# EAGLE board AllInOne (EAGLE 6.2), part 1 of 2
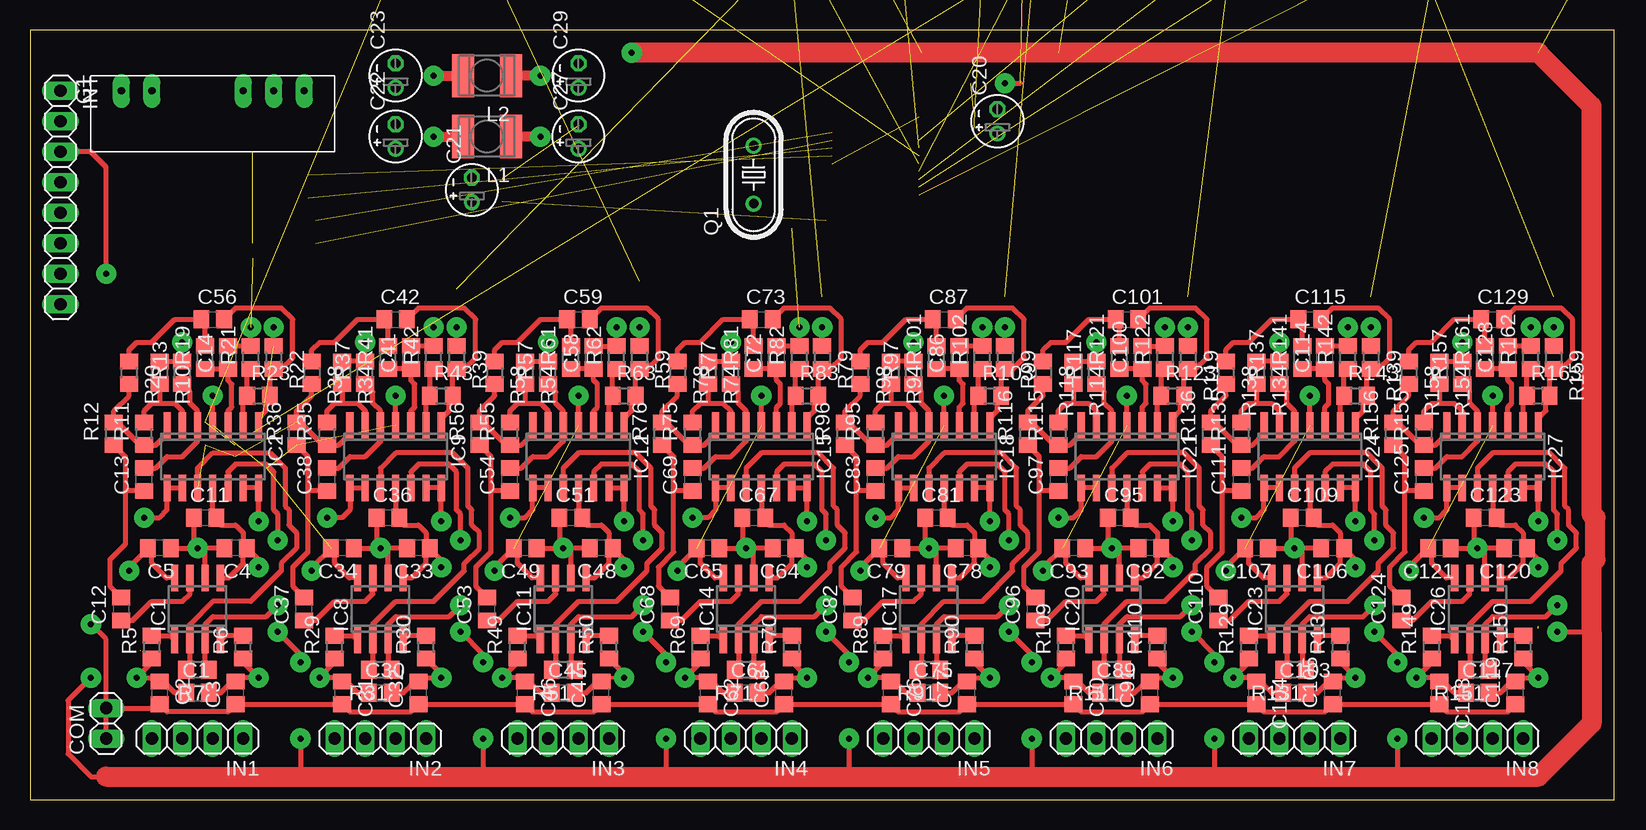
[diagram p6: board, top side]
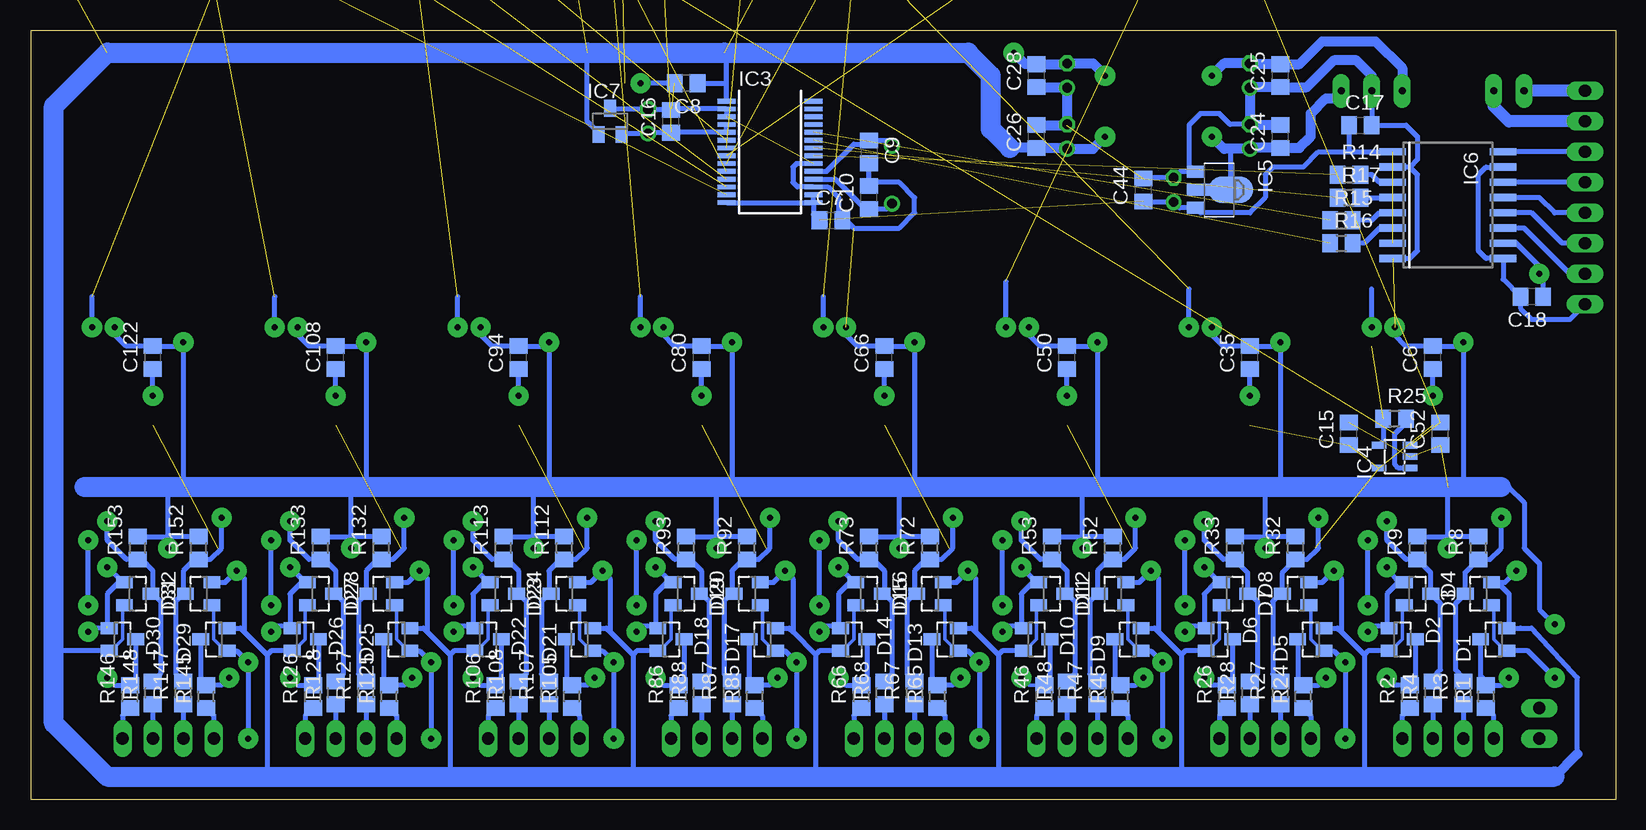
[diagram p7: board, bottom side, seen from below]

Size 132.07 x 64.12 mm. Coordinates in mm from the lower left corner, seen from the top.
Outline: 0,0 132.07,0 132.07,64.12 0,64.12 0,0
Copper layers (1*16): Top 0.035mm / dielectric 1.5mm / Bottom 0.035mm
Design rules: minimum track width 10mil, minimum drill 24mil, track to track 8mil, track to pad 8mil, pad to pad 8mil, via to via 8mil, smd to smd 8mil, copper to edge 40mil, drill to drill 8mil, minimum pad ring 10mil, minimum via ring 8mil, stop-mask expansion 4mil, vias tented up to drill 0mil, thermal gap 10mil

## Footprints (pad centres in the part's own frame; a part is rotated, then mirrored left to right if it is on the bottom)
C0805 = smd 1.3 x 1.5: 1 -0.95,0; 2 0.95,0
E2-4 = drill 0.813 pad 1.27: + -1.016,0 | drill 0.813 pad 1.27 octagon: - 1.016,0
1X02 = drill 1.016 long: 1 -1.27,0; 2 1.27,0
SOT23 = smd 1 x 1.4: 1 -0.95,-1.1; 2 0.95,-1.1; 3 0,1.1
TMV0505D = drill 0.6 pad 1.422 long: 1 0,7.62; 2 0,5.08; 5 0,-2.54; 6 0,-5.08; 7 0,-7.62
SO-08 = smd 0.6 x 2.2: 1 -1.905,-2.6; 2 -0.635,-2.6; 3 0.635,-2.6; 4 1.905,-2.6; 5 1.905,2.6; 6 0.635,2.6; 7 -0.635,2.6; 8 -1.905,2.6
TLC2254ID = smd 0.6 x 2.2: 1 -3.81,-2.6; 2 -2.54,-2.6; 3 -1.27,-2.6; 4 0,-2.6; 5 1.27,-2.6; 6 2.54,-2.6; 7 3.81,-2.6; 8 3.81,2.6; 9 2.54,2.6; 10 1.27,2.6; 11 0,2.6; 12 -1.27,2.6; 13 -2.54,2.6; 14 -3.81,2.6
ADS1256IDBT = smd 0.4 x 1.5: 1 -4.225,-3.625; 2 -3.575,-3.625; 3 -2.925,-3.625; 4 -2.275,-3.625; 5 -1.625,-3.625; 6 -0.975,-3.625; 7 -0.325,-3.625; 8 0.325,-3.625; 9 0.975,-3.625; 10 1.625,-3.625; 11 2.275,-3.625; 12 2.925,-3.625; 13 3.575,-3.625; 14 4.225,-3.625; 15 4.225,3.625; 16 3.575,3.625; 17 2.925,3.625; 18 2.275,3.625; 19 1.625,3.625; 20 0.975,3.625; 21 0.325,3.625; 22 -0.325,3.625; 23 -0.975,3.625; 24 -1.625,3.625; 25 -2.275,3.625; 26 -2.925,3.625; 27 -3.575,3.625; 28 -4.225,3.625
AD8605ARTZ = smd 0.55 x 1.2: 1 -0.95,-1.3; 2 0,-1.3; 3 0.95,-1.3; 4 0.95,1.3; 5 -0.95,1.3
SOT89 = smd 1 x 1.5: 1 -1.499,-1.981; 3 1.499,-1.981 | smd 1 x 2: 2 0,-1.727 | smd 2.2 x 3.7: 2@1 0,0.94
ADUM1402ARWZ = smd 0.6 x 2.2: 1 -4.445,-4.6; 2 -3.175,-4.6; 3 -1.905,-4.6; 4 -0.635,-4.6; 5 0.635,-4.6; 6 1.905,-4.6; 7 3.175,-4.6; 8 4.445,-4.6; 9 4.445,4.6; 10 3.175,4.6; 11 1.905,4.6; 12 0.635,4.6; 13 -0.635,4.6; 14 -1.905,4.6; 15 -3.175,4.6; 16 -4.445,4.6
REF3125AIDBZT = smd 1 x 1.4: 1 -0.95,-1.1; 2 0.95,-1.1; 3 0,1.1
1X04 = drill 1.016 long: 1 -3.81,0; 2 -1.27,0; 3 1.27,0; 4 3.81,0
1X08 = drill 1.016 long: 1 -8.89,0; 2 -6.35,0; 3 -3.81,0; 4 -1.27,0; 5 1.27,0; 6 3.81,0; 7 6.35,0; 8 8.89,0
L4532P = smd 1.8 x 3.6: 1 -2,0; 2 2,0
HC49U-V = drill 0.813: 1 -2.413,0; 2 2.413,0
R0805 = smd 1.3 x 1.5: 1 -0.95,0; 2 0.95,0

## Placement (x,y rotation side)
C1  10pF  [C0805]  13.97,8.89 0 top
C2  100pF  [C0805]  10.79,8.89 270 top
C3  100pF  [C0805]  17.14,8.89 90 top
C4  0.1  [C0805]  17.14,20.95 180 top
C5  0.1  [C0805]  10.79,20.95 180 top
C6  0.1  [C0805]  15.24,36.83 90 bottom
C7  0.1  [C0805]  65.41,48.26 0 bottom
C8  0.1  [C0805]  77.47,59.69 180 bottom
C9  18p  [C0805]  62.23,53.98 270 bottom
C10  18p  [C0805]  62.23,50.16 90 bottom
C11  0.1  [C0805]  14.61,23.5 0 top
C12  1u  [C0805]  7.62,15.88 90 top
C13  1u  [C0805]  9.53,26.67 90 top
C14  47n  [C0805]  16.51,36.83 90 top
C15  0.1  [C0805]  22.23,30.48 90 bottom
C16  0.1  [C0805]  78.74,56.52 90 bottom
C17  0.1  [C0805]  21.27,56.2 0 bottom
C18  0.1  [C0805]  6.99,41.91 180 bottom
C19  0.1  [C0805]  94.61,71.12 90 top  (outside the outline)
C20  47u  [E2-4]  80.64,56.52 90 top
C21  47u  [E2-4]  36.83,50.8 90 top
C22  47u  [E2-4]  30.48,55.24 90 top
C23  47u  [E2-4]  30.48,60.33 90 top
C24  0.1  [C0805]  27.94,55.24 90 bottom
C25  0.1  [C0805]  27.94,60.33 90 bottom
C26  0.1  [C0805]  48.26,55.24 90 bottom
C27  47u  [E2-4]  45.72,55.24 90 top
C28  0.1  [C0805]  48.26,60.33 90 bottom
C29  47u  [E2-4]  45.72,60.33 90 top
C30  10pF  [C0805]  29.21,8.89 0 top
C31  100pF  [C0805]  26.04,8.89 270 top
C32  100pF  [C0805]  32.38,8.89 90 top
C33  0.1  [C0805]  32.38,20.95 180 top
C34  0.1  [C0805]  26.04,20.95 180 top
C35  0.1  [C0805]  30.48,36.83 90 bottom
C36  0.1  [C0805]  29.84,23.5 0 top
C37  1u  [C0805]  22.86,15.88 90 top
C38  1u  [C0805]  24.77,26.67 90 top
C39  0.1  [C0805]  37.47,83.82 0 top  (outside the outline)
C40  0.1  [C0805]  96.52,85.72 270 top  (outside the outline)
C41  47n  [C0805]  31.75,36.83 90 top
C42  33n  [C0805]  30.48,40.01 0 top
C43  0.1  [C0805]  43.18,79.38 0 top  (outside the outline)
C44  0.1  [C0805]  39.37,50.8 90 bottom
C45  10pF  [C0805]  44.45,8.89 0 top
C46  100pF  [C0805]  41.27,8.89 270 top
C47  100pF  [C0805]  47.62,8.89 90 top
C48  0.1  [C0805]  47.62,20.95 180 top
C49  0.1  [C0805]  41.27,20.95 180 top
C50  0.1  [C0805]  45.72,36.83 90 bottom
C51  0.1  [C0805]  45.09,23.5 0 top
C52  0.1  [C0805]  14.61,30.48 90 bottom
C53  1u  [C0805]  38.1,15.88 90 top
C54  1u  [C0805]  40.01,26.67 90 top
C55  0.1  [C0805]  52.7,78.11 0 top  (outside the outline)
C56  33n  [C0805]  15.24,40.01 0 top
C57  0.1  [C0805]  31.75,74.93 0 top  (outside the outline)
C58  47n  [C0805]  46.99,36.83 90 top
C59  33n  [C0805]  45.72,40.01 0 top
C60  0.1  [C0805]  36.83,78.74 0 top  (outside the outline)
C61  10pF  [C0805]  59.69,8.89 0 top
C62  100pF  [C0805]  56.52,8.89 270 top
C63  100pF  [C0805]  62.87,8.89 90 top
C64  0.1  [C0805]  62.87,20.95 180 top
C65  0.1  [C0805]  56.52,20.95 180 top
C66  0.1  [C0805]  60.96,36.83 90 bottom
C67  0.1  [C0805]  60.33,23.5 0 top
C68  1u  [C0805]  53.34,15.88 90 top
C69  1u  [C0805]  55.24,26.67 90 top
C70  0.1  [C0805]  69.85,72.39 0 top  (outside the outline)
C71  0.1  [C0805]  55.24,73.66 0 top  (outside the outline)
C72  47n  [C0805]  62.23,36.83 90 top
C73  33n  [C0805]  60.96,40.01 0 top
C74  0.1  [C0805]  62.23,73.03 0 top  (outside the outline)
C75  10pF  [C0805]  74.93,8.89 0 top
C76  100pF  [C0805]  71.75,8.89 270 top
C77  100pF  [C0805]  78.11,8.89 90 top
C78  0.1  [C0805]  78.11,20.95 180 top
C79  0.1  [C0805]  71.75,20.95 180 top
C80  0.1  [C0805]  76.2,36.83 90 bottom
C81  0.1  [C0805]  75.56,23.5 0 top
C82  1u  [C0805]  68.58,15.88 90 top
C83  1u  [C0805]  70.48,26.67 90 top
C84  0.1  [C0805]  88.27,71.75 0 top  (outside the outline)
C85  0.1  [C0805]  78.74,75.56 0 top  (outside the outline)
C86  47n  [C0805]  77.47,36.83 90 top
C87  33n  [C0805]  76.2,40.01 0 top
C88  0.1  [C0805]  83.82,73.03 0 top  (outside the outline)
C89  10pF  [C0805]  90.17,8.89 0 top
C90  100pF  [C0805]  87,8.89 270 top
C91  100pF  [C0805]  93.34,8.89 90 top
C92  0.1  [C0805]  93.34,20.95 180 top
C93  0.1  [C0805]  87,20.95 180 top
C94  0.1  [C0805]  91.44,36.83 90 bottom
C95  0.1  [C0805]  90.81,23.5 0 top
C96  1u  [C0805]  83.82,15.88 90 top
C97  1u  [C0805]  85.72,26.67 90 top
C98  0.1  [C0805]  106.68,71.75 0 top  (outside the outline)
C99  0.1  [C0805]  111.76,71.75 0 top  (outside the outline)
C100  47n  [C0805]  92.71,36.83 90 top
C101  33n  [C0805]  91.44,40.01 0 top
C102  0.1  [C0805]  105.41,76.2 0 top  (outside the outline)
C103  10pF  [C0805]  105.41,8.89 0 top
C104  100pF  [C0805]  102.23,8.89 270 top
C105  100pF  [C0805]  108.58,8.89 90 top
C106  0.1  [C0805]  108.58,20.95 180 top
C107  0.1  [C0805]  102.23,20.95 180 top
C108  0.1  [C0805]  106.68,36.83 90 bottom
C109  0.1  [C0805]  106.05,23.5 0 top
C110  1u  [C0805]  99.06,15.88 90 top
C111  1u  [C0805]  100.97,26.67 90 top
C112  0.1  [C0805]  99.06,81.28 0 top  (outside the outline)
C113  0.1  [C0805]  111.12,81.92 0 top  (outside the outline)
C114  47n  [C0805]  107.95,36.83 90 top
C115  33n  [C0805]  106.68,40.01 0 top
C116  0.1  [C0805]  116.2,87 0 top  (outside the outline)
C117  10pF  [C0805]  120.65,8.89 0 top
C118  100pF  [C0805]  117.47,8.89 270 top
C119  100pF  [C0805]  123.83,8.89 90 top
C120  0.1  [C0805]  123.83,20.95 180 top
C121  0.1  [C0805]  117.47,20.95 180 top
C122  0.1  [C0805]  121.92,36.83 90 bottom
C123  0.1  [C0805]  121.28,23.5 0 top
C124  1u  [C0805]  114.3,15.88 90 top
C125  1u  [C0805]  116.2,26.67 90 top
C126  0.1  [C0805]  133.35,74.3 0 top  (outside the outline)
C127  0.1  [C0805]  142.24,65.41 0 top  (outside the outline)
C128  47n  [C0805]  123.19,36.83 90 top
C129  33n  [C0805]  121.92,40.01 0 top
C130  0.1  [C0805]  124.46,71.75 0 top  (outside the outline)
COM  COM  [1X02]  6.35,6.35 90 top
D1  BAV199  [SOT23]  10.16,13.34 90 bottom
D2  BAV199  [SOT23]  17.78,13.34 270 bottom
D3  BAV199  [SOT23]  11.43,17.14 90 bottom
D4  BAV199  [SOT23]  16.51,17.14 270 bottom
D5  BAV199  [SOT23]  25.4,13.34 90 bottom
D6  BAV199  [SOT23]  33.02,13.34 270 bottom
D7  BAV199  [SOT23]  26.67,17.14 90 bottom
D8  BAV199  [SOT23]  31.75,17.14 270 bottom
D9  BAV199  [SOT23]  40.64,13.34 90 bottom
D10  BAV199  [SOT23]  48.26,13.34 270 bottom
D11  BAV199  [SOT23]  41.91,17.14 90 bottom
D12  BAV199  [SOT23]  46.99,17.14 270 bottom
D13  BAV199  [SOT23]  55.88,13.34 90 bottom
D14  BAV199  [SOT23]  63.5,13.34 270 bottom
D15  BAV199  [SOT23]  57.15,17.14 90 bottom
D16  BAV199  [SOT23]  62.23,17.14 270 bottom
D17  BAV199  [SOT23]  71.12,13.34 90 bottom
D18  BAV199  [SOT23]  78.74,13.34 270 bottom
D19  BAV199  [SOT23]  72.39,17.14 90 bottom
D20  BAV199  [SOT23]  77.47,17.14 270 bottom
D21  BAV199  [SOT23]  86.36,13.34 90 bottom
D22  BAV199  [SOT23]  93.98,13.34 270 bottom
D23  BAV199  [SOT23]  87.63,17.14 90 bottom
D24  BAV199  [SOT23]  92.71,17.14 270 bottom
D25  BAV199  [SOT23]  101.6,13.34 90 bottom
D26  BAV199  [SOT23]  109.22,13.34 270 bottom
D27  BAV199  [SOT23]  102.87,17.14 90 bottom
D28  BAV199  [SOT23]  107.95,17.14 270 bottom
D29  BAV199  [SOT23]  116.84,13.34 90 bottom
D30  BAV199  [SOT23]  124.46,13.34 270 bottom
D31  BAV199  [SOT23]  118.11,17.14 90 bottom
D32  BAV199  [SOT23]  123.19,17.14 270 bottom
G1  TMV0505D  [TMV0505D]  15.24,59.05 90 top
IC1  AD8221ARZ  [SO-08]  13.97,15.88 0 top
IC2  TLC2254ID  [TLC2254ID]  15.24,28.57 180 top
IC3  ADS1256IDBT  [ADS1256IDBT]  70.48,53.98 270 bottom
IC4  AD8605ARTZ  [AD8605ARTZ]  18.41,28.57 90 bottom
IC5  MCP170333MB  [SOT89]  33.02,50.8 270 bottom
IC6  ADUM1402ARWZ  [ADUM1402ARWZ]  13.97,49.53 270 bottom
IC7  REF3125AIDBZT  [REF3125AIDBZT]  83.82,56.52 0 bottom
IC8  AD8221ARZ  [SO-08]  29.21,15.88 0 top
IC9  TLC2254ID  [TLC2254ID]  30.48,28.57 180 top
IC10  AD8605ARTZ  [AD8605ARTZ]  74.3,81.92 0 top  (outside the outline)
IC11  AD8221ARZ  [SO-08]  44.45,15.88 0 top
IC12  TLC2254ID  [TLC2254ID]  45.72,28.57 180 top
IC13  AD8605ARTZ  [AD8605ARTZ]  32.38,85.09 0 top  (outside the outline)
IC14  AD8221ARZ  [SO-08]  59.69,15.88 0 top
IC15  TLC2254ID  [TLC2254ID]  60.96,28.57 180 top
IC16  AD8605ARTZ  [AD8605ARTZ]  58.42,79.38 0 top  (outside the outline)
IC17  AD8221ARZ  [SO-08]  74.93,15.88 0 top
IC18  TLC2254ID  [TLC2254ID]  76.2,28.57 180 top
IC19  AD8605ARTZ  [AD8605ARTZ]  83.82,80.64 0 top  (outside the outline)
IC20  AD8221ARZ  [SO-08]  90.17,15.88 0 top
IC21  TLC2254ID  [TLC2254ID]  91.44,28.57 180 top
IC22  AD8605ARTZ  [AD8605ARTZ]  99.69,73.03 0 top  (outside the outline)
IC23  AD8221ARZ  [SO-08]  105.41,15.88 0 top
IC24  TLC2254ID  [TLC2254ID]  106.68,28.57 180 top
IC25  AD8605ARTZ  [AD8605ARTZ]  128.27,79.38 0 top  (outside the outline)
IC26  AD8221ARZ  [SO-08]  120.65,15.88 0 top
IC27  TLC2254ID  [TLC2254ID]  121.92,28.57 180 top
IC28  AD8605ARTZ  [AD8605ARTZ]  137.79,71.75 0 top  (outside the outline)
IN1  IN1  [1X04]  13.97,5.08 180 top
IN2  IN2  [1X04]  29.21,5.08 180 top
IN3  IN3  [1X04]  44.45,5.08 180 top
IN4  IN4  [1X04]  59.69,5.08 180 top
IN5  IN5  [1X04]  74.93,5.08 180 top
IN6  IN6  [1X04]  90.17,5.08 180 top
IN7  IN7  [1X04]  105.41,5.08 180 top
IN8  IN8  [1X04]  120.65,5.08 180 top
INT  INT  [1X08]  2.54,50.16 270 top
L1  100uH  [L4532P]  38.1,55.24 180 top
L2  100uH  [L4532P]  38.1,60.33 180 top
Q1  8MHz  [HC49U-V]  60.33,52.07 90 top
R1  2K2  [R0805]  10.79,8.57 90 bottom
R2  2K2  [R0805]  17.14,8.57 90 bottom
R3  100  [R0805]  12.7,8.89 90 bottom
R4  100  [R0805]  15.24,8.89 90 bottom
R5  2K2  [R0805]  10.16,12.7 90 top
R6  2K2  [R0805]  17.78,12.7 90 top
R7  2K  [R0805]  13.97,10.79 180 top
R8  100K  [R0805]  11.43,20.95 90 bottom
R9  100K  [R0805]  16.51,20.95 90 bottom
R10  100K  [R0805]  10.79,35.56 270 top
R11  910K  [R0805]  9.53,30.48 90 top
R12  680K  [R0805]  6.99,30.48 90 top
R13  100K  [R0805]  12.7,35.56 90 top
R14  100  [R0805]  22.23,52.07 0 bottom
R15  100  [R0805]  22.86,48.26 0 bottom
R16  100  [R0805]  22.86,46.35 0 bottom
R17  100  [R0805]  22.23,50.16 0 bottom
R18  100  [R0805]  93.98,77.47 270 top  (outside the outline)
R19  100K  [R0805]  14.61,36.83 90 top
R20  100K  [R0805]  8.26,35.56 270 top
R21  100K  [R0805]  18.41,36.83 90 top
R22  1K  [R0805]  20.32,36.83 270 top
R23  100K  [R0805]  19.05,33.66 0 top
R24  2K2  [R0805]  26.04,8.57 90 bottom
R25  1K  [R0805]  18.41,31.75 0 bottom
R26  2K2  [R0805]  32.38,8.57 90 bottom
R27  100  [R0805]  27.94,8.89 90 bottom
R28  100  [R0805]  30.48,8.89 90 bottom
R29  2K2  [R0805]  25.4,12.7 90 top
R30  2K2  [R0805]  33.02,12.7 90 top
R31  2K  [R0805]  29.21,10.79 180 top
R32  100K  [R0805]  26.67,20.95 90 bottom
R33  100K  [R0805]  31.75,20.95 90 bottom
R34  100K  [R0805]  26.04,35.56 270 top
R35  910K  [R0805]  24.77,30.48 90 top
R36  680K  [R0805]  22.23,30.48 90 top
R37  100K  [R0805]  27.94,35.56 90 top
R38  100K  [R0805]  23.5,35.56 270 top
R39  1K  [R0805]  35.56,36.83 270 top
R40  1K  [R0805]  79.38,86.36 180 top  (outside the outline)
R41  100K  [R0805]  29.84,36.83 90 top
R42  100K  [R0805]  33.66,36.83 90 top
R43  100K  [R0805]  34.29,33.66 0 top
R44  100  [R0805]  73.03,76.2 0 top  (outside the outline)
R45  2K2  [R0805]  41.27,8.57 90 bottom
R46  2K2  [R0805]  47.62,8.57 90 bottom
R47  100  [R0805]  43.18,8.89 90 bottom
R48  100  [R0805]  45.72,8.89 90 bottom
R49  2K2  [R0805]  40.64,12.7 90 top
R50  2K2  [R0805]  48.26,12.7 90 top
R51  2K  [R0805]  44.45,10.79 180 top
R52  100K  [R0805]  41.91,20.95 90 bottom
R53  100K  [R0805]  46.99,20.95 90 bottom
R54  100K  [R0805]  41.27,35.56 270 top
R55  910K  [R0805]  40.01,30.48 90 top
R56  680K  [R0805]  37.47,30.48 90 top
R57  100K  [R0805]  43.18,35.56 90 top
R58  100K  [R0805]  38.73,35.56 270 top
R59  1K  [R0805]  50.8,36.83 270 top
R60  1K  [R0805]  36.83,74.93 0 top  (outside the outline)
R61  100K  [R0805]  45.09,36.83 90 top
R62  100K  [R0805]  48.9,36.83 90 top
R63  100K  [R0805]  49.53,33.66 0 top
R64  100  [R0805]  31.75,79.38 0 top  (outside the outline)
R65  2K2  [R0805]  56.52,8.57 90 bottom
R66  2K2  [R0805]  62.87,8.57 90 bottom
R67  100  [R0805]  58.42,8.89 90 bottom
R68  100  [R0805]  60.96,8.89 90 bottom
R69  2K2  [R0805]  55.88,12.7 90 top
R70  2K2  [R0805]  63.5,12.7 90 top
R71  2K  [R0805]  59.69,10.79 180 top
R72  100K  [R0805]  57.15,20.95 90 bottom
R73  100K  [R0805]  62.23,20.95 90 bottom
R74  100K  [R0805]  56.52,35.56 270 top
R75  910K  [R0805]  55.24,30.48 90 top
R76  680K  [R0805]  52.7,30.48 90 top
R77  100K  [R0805]  58.42,35.56 90 top
R78  100K  [R0805]  53.98,35.56 270 top
R79  1K  [R0805]  66.04,36.83 270 top
R80  1K  [R0805]  63.5,79.38 0 top  (outside the outline)
R81  100K  [R0805]  60.33,36.83 90 top
R82  100K  [R0805]  64.14,36.83 90 top
R83  100K  [R0805]  64.77,33.66 0 top
R84  100  [R0805]  68.58,83.82 0 top  (outside the outline)
R85  2K2  [R0805]  71.75,8.57 90 bottom
R86  2K2  [R0805]  78.11,8.57 90 bottom
R87  100  [R0805]  73.66,8.89 90 bottom
R88  100  [R0805]  76.2,8.89 90 bottom
R89  2K2  [R0805]  71.12,12.7 90 top
R90  2K2  [R0805]  78.74,12.7 90 top
R91  2K  [R0805]  74.93,10.79 180 top
R92  100K  [R0805]  72.39,20.95 90 bottom
R93  100K  [R0805]  77.47,20.95 90 bottom
R94  100K  [R0805]  71.75,35.56 270 top
R95  910K  [R0805]  70.48,30.48 90 top
R96  680K  [R0805]  67.94,30.48 90 top
R97  100K  [R0805]  73.66,35.56 90 top
R98  100K  [R0805]  69.22,35.56 270 top
R99  1K  [R0805]  81.28,36.83 270 top
R100  1K  [R0805]  91.44,81.92 0 top  (outside the outline)
R101  100K  [R0805]  75.56,36.83 90 top
R102  100K  [R0805]  79.38,36.83 90 top
R103  100K  [R0805]  80.01,33.66 0 top
R104  100  [R0805]  88.27,76.83 0 top  (outside the outline)
R105  2K2  [R0805]  87,8.57 90 bottom
R106  2K2  [R0805]  93.34,8.57 90 bottom
R107  100  [R0805]  88.9,8.89 90 bottom
R108  100  [R0805]  91.44,8.89 90 bottom
R109  2K2  [R0805]  86.36,12.7 90 top
R110  2K2  [R0805]  93.98,12.7 90 top
R111  2K  [R0805]  90.17,10.79 180 top
R112  100K  [R0805]  87.63,20.95 90 bottom
R113  100K  [R0805]  92.71,20.95 90 bottom
R114  100K  [R0805]  87,35.56 270 top
R115  910K  [R0805]  85.72,30.48 90 top
R116  680K  [R0805]  83.19,30.48 90 top
R117  100K  [R0805]  88.9,35.56 90 top
R118  100K  [R0805]  84.45,35.56 270 top
R119  1K  [R0805]  96.52,36.83 270 top
R120  1K  [R0805]  110.49,77.47 0 top  (outside the outline)
R121  100K  [R0805]  90.81,36.83 90 top
R122  100K  [R0805]  94.61,36.83 90 top
R123  100K  [R0805]  95.25,33.66 0 top
R124  100  [R0805]  105.41,81.28 0 top  (outside the outline)
R125  2K2  [R0805]  102.23,8.57 90 bottom
R126  2K2  [R0805]  108.58,8.57 90 bottom
R127  100  [R0805]  104.14,8.89 90 bottom
R128  100  [R0805]  106.68,8.89 90 bottom
R129  2K2  [R0805]  101.6,12.7 90 top
R130  2K2  [R0805]  109.22,12.7 90 top
R131  2K  [R0805]  105.41,10.79 180 top
R132  100K  [R0805]  102.87,20.95 90 bottom
R133  100K  [R0805]  107.95,20.95 90 bottom
R134  100K  [R0805]  102.23,35.56 270 top
R135  910K  [R0805]  100.97,30.48 90 top
R136  680K  [R0805]  98.42,30.48 90 top
R137  100K  [R0805]  104.14,35.56 90 top
R138  100K  [R0805]  99.69,35.56 270 top
R139  1K  [R0805]  111.76,36.83 270 top
R140  1K  [R0805]  118.75,73.03 0 top  (outside the outline)
R141  100K  [R0805]  106.05,36.83 90 top
R142  100K  [R0805]  109.86,36.83 90 top
R143  100K  [R0805]  110.49,33.66 0 top
R144  100  [R0805]  119.38,79.38 0 top  (outside the outline)
R145  2K2  [R0805]  117.47,8.57 90 bottom
R146  2K2  [R0805]  123.83,8.57 90 bottom
R147  100  [R0805]  119.38,8.89 90 bottom
R148  100  [R0805]  121.92,8.89 90 bottom
R149  2K2  [R0805]  116.84,12.7 90 top
R150  2K2  [R0805]  124.46,12.7 90 top
R151  2K  [R0805]  120.65,10.79 180 top
R152  100K  [R0805]  118.11,20.95 90 bottom
R153  100K  [R0805]  123.19,20.95 90 bottom
R154  100K  [R0805]  117.47,35.56 270 top
R155  910K  [R0805]  116.2,30.48 90 top
R156  680K  [R0805]  113.67,30.48 90 top
R157  100K  [R0805]  119.38,35.56 90 top
R158  100K  [R0805]  114.94,35.56 270 top
R159  1K  [R0805]  127,36.83 270 top
R160  1K  [R0805]  116.84,69.85 0 top  (outside the outline)
R161  100K  [R0805]  121.28,36.83 90 top
R162  100K  [R0805]  125.09,36.83 90 top
R163  100K  [R0805]  125.73,33.66 0 top
R164  100  [R0805]  111.12,68.58 0 top  (outside the outline)